# Altium project line-detector.PrjPCB
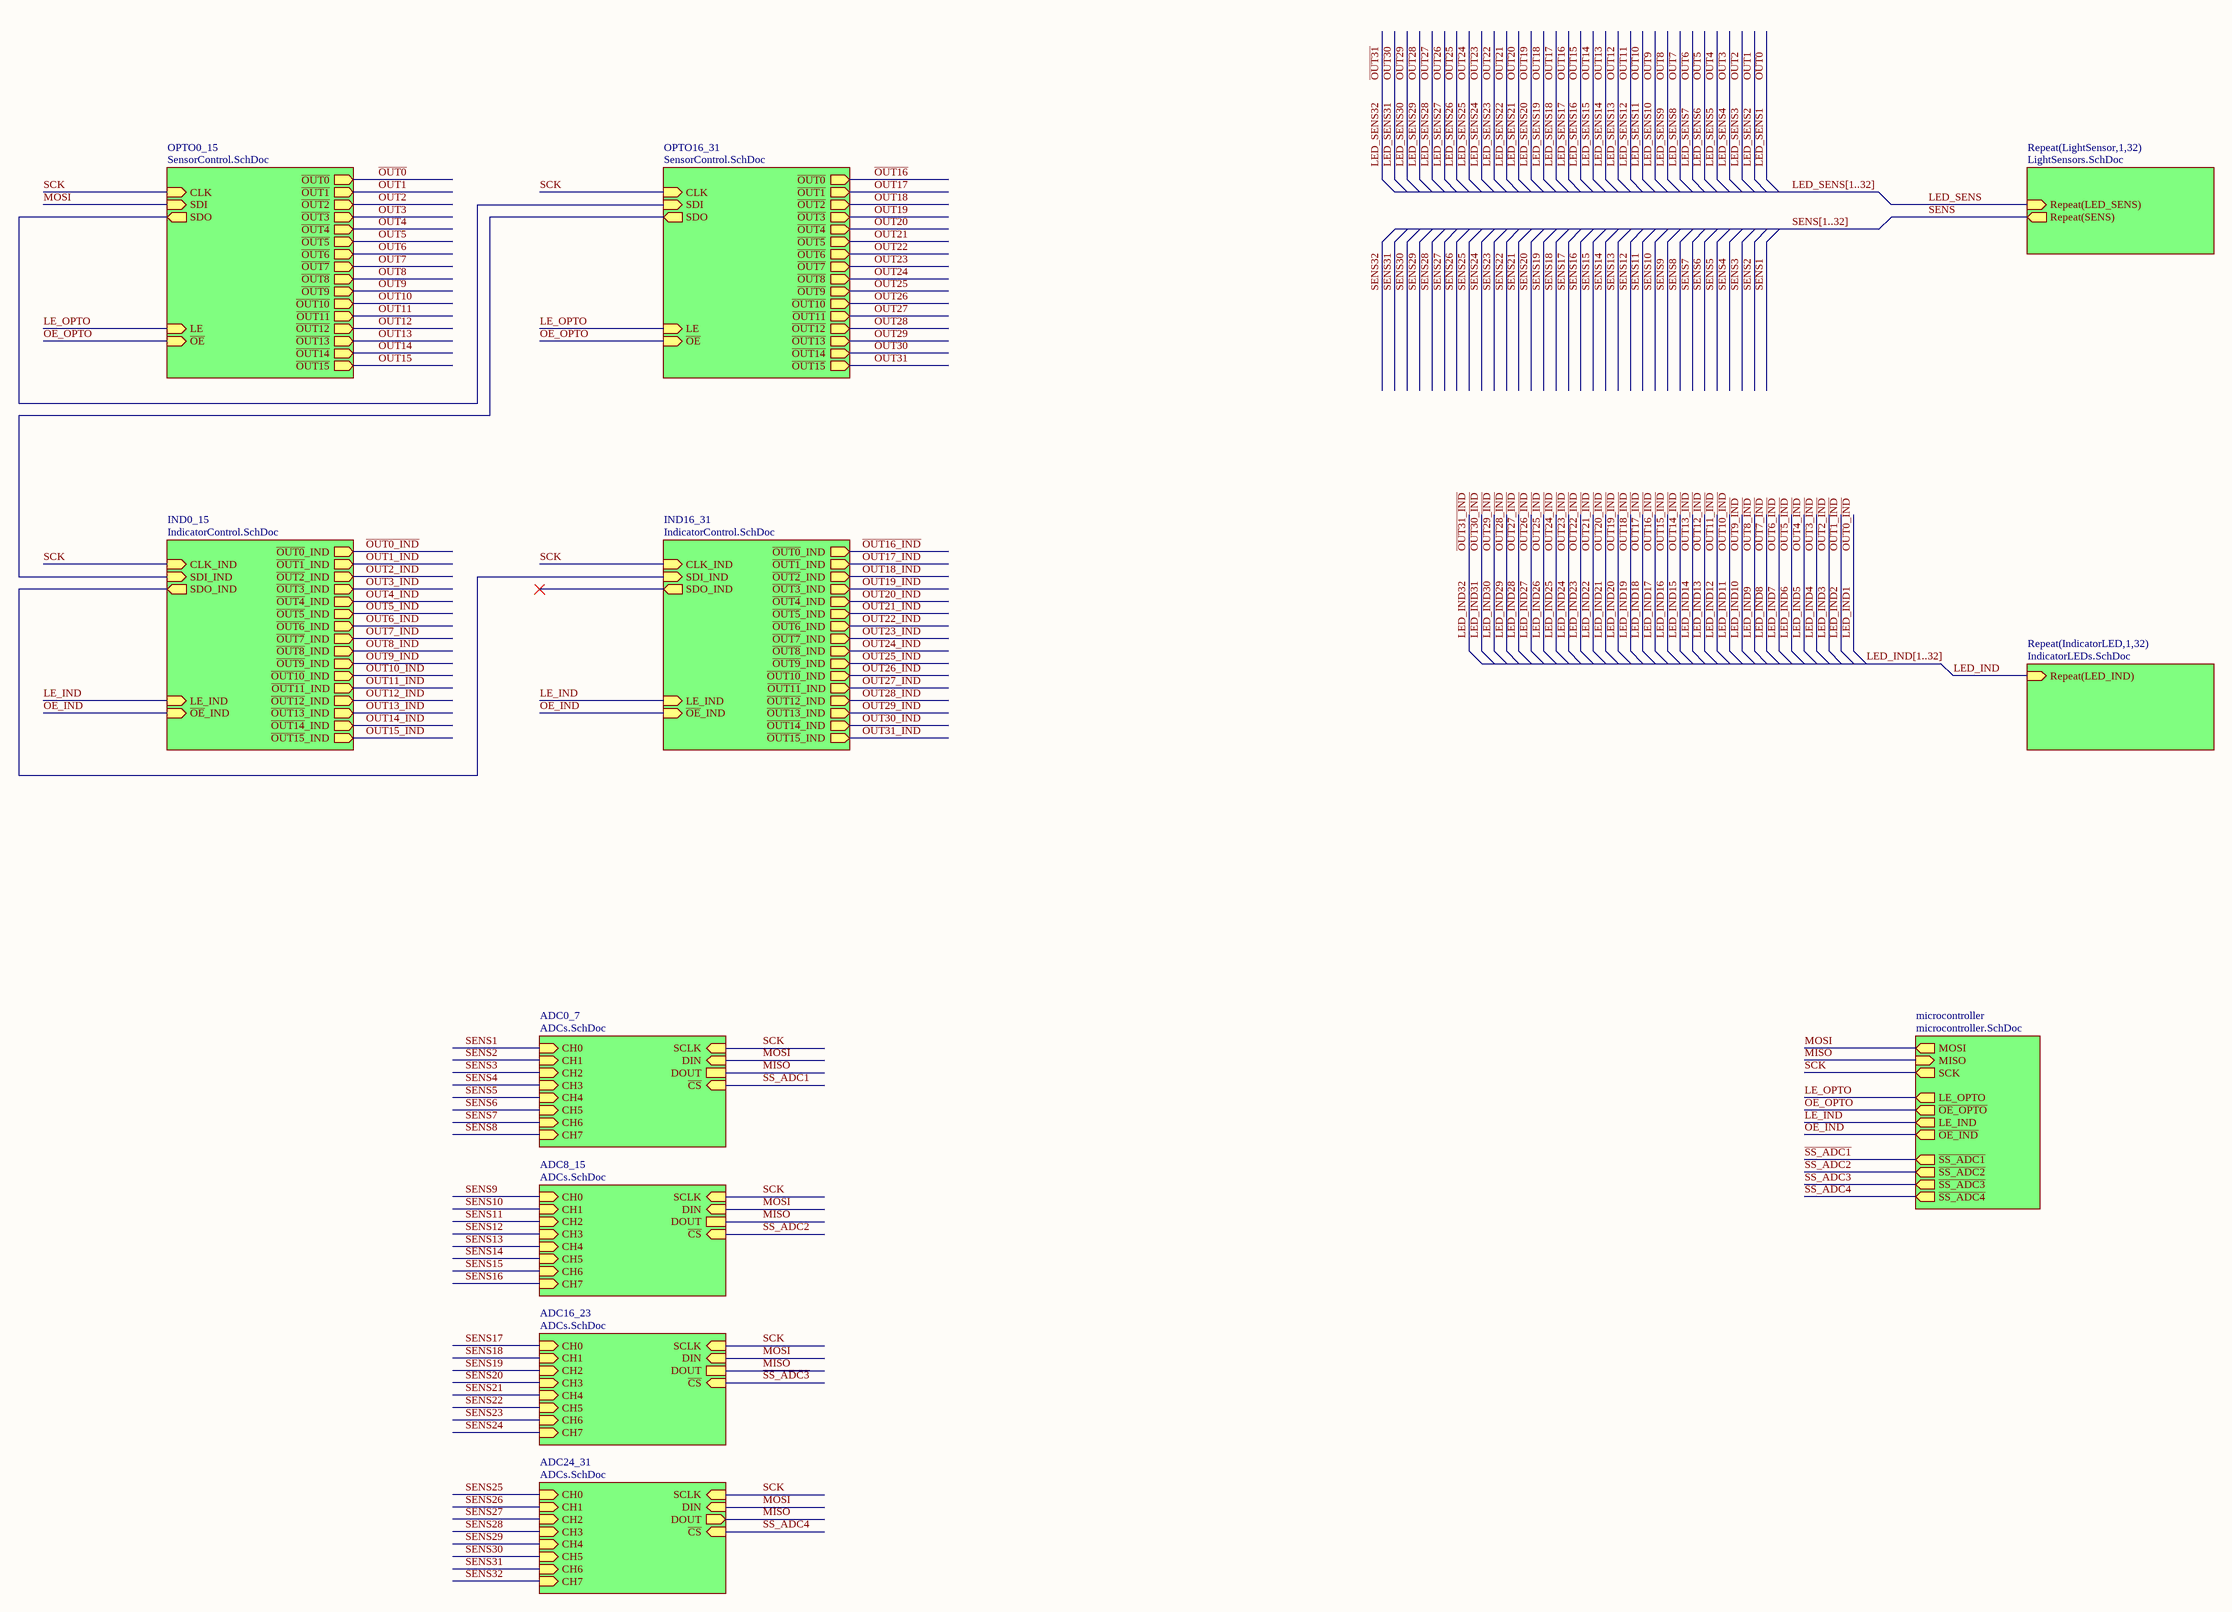
[diagram p0: Main.SchDoc]
7 sheets, 134 parts. Net scope: hierarchical (ports join the sheet entries above them; power ports are global).
Board files: Main.PcbDoc, RPI 3.PcbDoc
Sheets:
  Main.SchDoc
    OPTO0_15 = SensorControl.SchDoc
    OPTO16_31 = SensorControl.SchDoc
    IND0_15 = IndicatorControl.SchDoc
    IND16_31 = IndicatorControl.SchDoc
    microcontroller = microcontroller.SchDoc
    ADC0_7 = ADCs.SchDoc
    ADC8_15 = ADCs.SchDoc
    ADC16_23 = ADCs.SchDoc
    ADC24_31 = ADCs.SchDoc
    IndicatorLED1 = IndicatorLEDs.SchDoc
    IndicatorLED2 = IndicatorLEDs.SchDoc
    IndicatorLED3 = IndicatorLEDs.SchDoc
    IndicatorLED4 = IndicatorLEDs.SchDoc
    IndicatorLED5 = IndicatorLEDs.SchDoc
    IndicatorLED6 = IndicatorLEDs.SchDoc
    IndicatorLED7 = IndicatorLEDs.SchDoc
    IndicatorLED8 = IndicatorLEDs.SchDoc
    IndicatorLED9 = IndicatorLEDs.SchDoc
    IndicatorLED10 = IndicatorLEDs.SchDoc
    IndicatorLED11 = IndicatorLEDs.SchDoc
    IndicatorLED12 = IndicatorLEDs.SchDoc
    IndicatorLED13 = IndicatorLEDs.SchDoc
    IndicatorLED14 = IndicatorLEDs.SchDoc
    IndicatorLED15 = IndicatorLEDs.SchDoc
    IndicatorLED16 = IndicatorLEDs.SchDoc
    IndicatorLED17 = IndicatorLEDs.SchDoc
    IndicatorLED18 = IndicatorLEDs.SchDoc
    IndicatorLED19 = IndicatorLEDs.SchDoc
    IndicatorLED20 = IndicatorLEDs.SchDoc
    IndicatorLED21 = IndicatorLEDs.SchDoc
    IndicatorLED22 = IndicatorLEDs.SchDoc
    IndicatorLED23 = IndicatorLEDs.SchDoc
    IndicatorLED24 = IndicatorLEDs.SchDoc
    IndicatorLED25 = IndicatorLEDs.SchDoc
    IndicatorLED26 = IndicatorLEDs.SchDoc
    IndicatorLED27 = IndicatorLEDs.SchDoc
    IndicatorLED28 = IndicatorLEDs.SchDoc
    IndicatorLED29 = IndicatorLEDs.SchDoc
    IndicatorLED30 = IndicatorLEDs.SchDoc
    IndicatorLED31 = IndicatorLEDs.SchDoc
    IndicatorLED32 = IndicatorLEDs.SchDoc
    LightSensor1 = LightSensors.SchDoc
    LightSensor2 = LightSensors.SchDoc
    LightSensor3 = LightSensors.SchDoc
    LightSensor4 = LightSensors.SchDoc
    LightSensor5 = LightSensors.SchDoc
    LightSensor6 = LightSensors.SchDoc
    LightSensor7 = LightSensors.SchDoc
    LightSensor8 = LightSensors.SchDoc
    LightSensor9 = LightSensors.SchDoc
    LightSensor10 = LightSensors.SchDoc
    LightSensor11 = LightSensors.SchDoc
    LightSensor12 = LightSensors.SchDoc
    LightSensor13 = LightSensors.SchDoc
    LightSensor14 = LightSensors.SchDoc
    LightSensor15 = LightSensors.SchDoc
    LightSensor16 = LightSensors.SchDoc
    LightSensor17 = LightSensors.SchDoc
    LightSensor18 = LightSensors.SchDoc
    LightSensor19 = LightSensors.SchDoc
    LightSensor20 = LightSensors.SchDoc
    LightSensor21 = LightSensors.SchDoc
    LightSensor22 = LightSensors.SchDoc
    LightSensor23 = LightSensors.SchDoc
    LightSensor24 = LightSensors.SchDoc
    LightSensor25 = LightSensors.SchDoc
    LightSensor26 = LightSensors.SchDoc
    LightSensor27 = LightSensors.SchDoc
    LightSensor28 = LightSensors.SchDoc
    LightSensor29 = LightSensors.SchDoc
    LightSensor30 = LightSensors.SchDoc
    LightSensor31 = LightSensors.SchDoc
    LightSensor32 = LightSensors.SchDoc

## Sheet Main.SchDoc
size A2

### Sub-sheets
ADC0_7 = ADCs.SchDoc: CH0 (in), CH1 (in), CH2 (in), CH3 (in), CH4 (in), CH5 (in), CH6 (in), CH7 (in), SCLK (in), ~{CS} (in), DIN (in), DOUT
ADC8_15 = ADCs.SchDoc: CH0 (in), CH1 (in), CH2 (in), CH3 (in), CH4 (in), CH5 (in), CH6 (in), CH7 (in), SCLK (in), ~{CS} (in), DIN (in), DOUT
ADC16_23 = ADCs.SchDoc: CH0 (in), CH1 (in), CH2 (in), CH3 (in), CH4 (in), CH5 (in), CH6 (in), CH7 (in), SCLK (in), ~{CS} (in), DIN (in), DOUT
ADC24_31 = ADCs.SchDoc: CH0 (in), CH1 (in), CH2 (in), CH3 (in), CH4 (in), CH5 (in), CH6 (in), CH7 (in), SCLK (in), ~{CS} (in), DIN (in), DOUT (out)
IND0_15 = IndicatorControl.SchDoc: ~{OUT0}_IND (out), ~{OUT1}_IND (out), ~{OUT2}_IND (out), ~{OUT3}_IND (out), ~{OUT4}_IND (out), ~{OUT5}_IND (out), ~{OUT6}_IND (out), ~{OUT7}_IND (out), ~{OUT8}_IND (out), ~{OUT9}_IND (out), ~{OUT10}_IND (out), ~{OUT11}_IND (out), ~{OUT12}_IND (out), ~{OUT13}_IND (out), ~{OUT14}_IND (out), ~{OUT15}_IND (out), SDI_IND (in), ~{OE}_IND (in), CLK_IND (in), LE_IND (in), SDO_IND (out)
IND16_31 = IndicatorControl.SchDoc: ~{OUT0}_IND (out), ~{OUT1}_IND (out), ~{OUT2}_IND (out), ~{OUT3}_IND (out), ~{OUT4}_IND (out), ~{OUT5}_IND (out), ~{OUT6}_IND (out), ~{OUT7}_IND (out), ~{OUT8}_IND (out), ~{OUT9}_IND (out), ~{OUT10}_IND (out), ~{OUT11}_IND (out), ~{OUT12}_IND (out), ~{OUT13}_IND (out), ~{OUT14}_IND (out), ~{OUT15}_IND (out), SDI_IND (in), ~{OE}_IND (in), CLK_IND (in), LE_IND (in), SDO_IND (out)
microcontroller = microcontroller.SchDoc: LE_IND (out), ~{OE_IND} (out), ~{SS_ADC4} (out), LE_OPTO (out), ~{SS_ADC3} (out), MOSI (out), SCK (out), ~{OE_OPTO} (out), ~{SS_ADC1} (out), ~{SS_ADC2} (out), MISO (in)
OPTO0_15 = SensorControl.SchDoc: ~{OUT0} (out), ~{OUT1} (out), ~{OUT2} (out), ~{OUT3} (out), ~{OUT4} (out), ~{OUT5} (out), ~{OUT6} (out), ~{OUT7} (out), ~{OUT8} (out), ~{OUT9} (out), ~{OUT10} (out), ~{OUT11} (out), ~{OUT12} (out), ~{OUT13} (out), ~{OUT14} (out), ~{OUT15} (out), SDI (in), ~{OE} (in), CLK (in), LE (in), SDO (out)
OPTO16_31 = SensorControl.SchDoc: ~{OUT0} (out), ~{OUT1} (out), ~{OUT2} (out), ~{OUT3} (out), ~{OUT4} (out), ~{OUT5} (out), ~{OUT6} (out), ~{OUT7} (out), ~{OUT8} (out), ~{OUT9} (out), ~{OUT10} (out), ~{OUT11} (out), ~{OUT12} (out), ~{OUT13} (out), ~{OUT14} (out), ~{OUT15} (out), SDI (in), ~{OE} (in), CLK (in), LE (in), SDO (out)
Repeat(IndicatorLED,1,32) = IndicatorLEDs.SchDoc: Repeat(LED_IND) (in)
Repeat(LightSensor,1,32) = LightSensors.SchDoc: Repeat(SENS) (out), Repeat(LED_SENS) (in)

### Nets
LE_IND: sheet IND0_15/LE_IND, sheet IND16_31/LE_IND, sheet microcontroller/LE_IND
LE_OPTO: sheet OPTO0_15/LE, sheet OPTO16_31/LE, sheet microcontroller/LE_OPTO
LED_IND: sheet Repeat(IndicatorLED,1,32)/Repeat(LED_IND)
LED_SENS: sheet Repeat(LightSensor,1,32)/Repeat(LED_SENS)
MISO: sheet microcontroller/MISO, sheet ADC0_7/DOUT, sheet ADC8_15/DOUT, sheet ADC16_23/DOUT, sheet ADC24_31/DOUT
MOSI: sheet OPTO0_15/SDI, sheet microcontroller/MOSI, sheet ADC0_7/DIN, sheet ADC8_15/DIN, sheet ADC16_23/DIN, sheet ADC24_31/DIN
~{OE_IND}: sheet IND0_15/~{OE}_IND, sheet IND16_31/~{OE}_IND, sheet microcontroller/~{OE_IND}
~{OE_OPTO}: sheet OPTO0_15/~{OE}, sheet OPTO16_31/~{OE}, sheet microcontroller/~{OE_OPTO}
~{SS_ADC1}: sheet microcontroller/~{SS_ADC1}, sheet ADC0_7/~{CS}
~{SS_ADC2}: sheet microcontroller/~{SS_ADC2}, sheet ADC8_15/~{CS}
~{SS_ADC3}: sheet microcontroller/~{SS_ADC3}, sheet ADC16_23/~{CS}
~{SS_ADC4}: sheet microcontroller/~{SS_ADC4}, sheet ADC24_31/~{CS}
SCK: sheet OPTO0_15/CLK, sheet OPTO16_31/CLK, sheet IND0_15/CLK_IND, sheet IND16_31/CLK_IND, sheet microcontroller/SCK, sheet ADC0_7/SCLK, sheet ADC8_15/SCLK, sheet ADC16_23/SCLK, sheet ADC24_31/SCLK
SENS: sheet Repeat(LightSensor,1,32)/Repeat(SENS)
NetIND0_15_2: sheet OPTO16_31/SDO, sheet IND0_15/SDI_IND
NetIND0_15_22: sheet IND0_15/SDO_IND, sheet IND16_31/SDI_IND
NetOPTO0_15_22: sheet OPTO0_15/SDO, sheet OPTO16_31/SDI

### Buses and harness runs
bus LED_IND[1..32]
bus LED_SENS[1..32]
bus SENS[1..32]

## Sheet SensorControl.SchDoc
size A4
Used 2 times, as channels OPTO0_15, OPTO16_31. Parts and nets are listed once, with the designators drawn on the sheet.
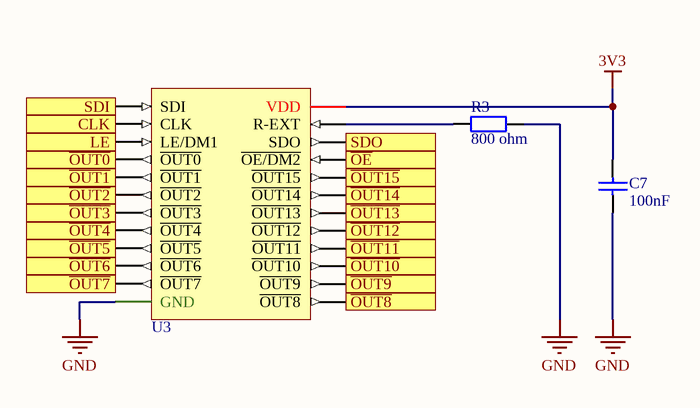
[diagram p1: SensorControl.SchDoc]

### Parts
C7  100nF  [FP_0805_CAP_085]
R3  Resistance: 800 ohm  [0805-W]  (hidden comment: CRCW0805806RFKEA)
U3  STP16CP05TTR  [24-Pin TSSOP]  (value not drawn)

### Ports
CLK (in), LE (in), SDI (in), SDO (out), ~{OE} (in), ~{OUT0} (out), ~{OUT1} (out), ~{OUT2} (out), ~{OUT3} (out), ~{OUT4} (out), ~{OUT5} (out), ~{OUT6} (out), ~{OUT7} (out), ~{OUT8} (out), ~{OUT9} (out), ~{OUT10} (out), ~{OUT11} (out), ~{OUT12} (out), ~{OUT13} (out), ~{OUT14} (out), ~{OUT15} (out)

### Nets
3V3: C7.2 U3.24(VDD)
GND: C7.1 R3.2 U3.1(GND)
CLK: U3.3(CLK) ; port CLK
LE: U3.4(LE/DM1) ; port LE
~{OE}: U3.21(~{OE/DM2}) ; port ~{OE}
~{OUT0}: U3.5(~{OUT0}) ; port ~{OUT0}
~{OUT1}: U3.6(~{OUT1}) ; port ~{OUT1}
~{OUT10}: U3.15(~{OUT10}) ; port ~{OUT10}
~{OUT11}: U3.16(~{OUT11}) ; port ~{OUT11}
~{OUT12}: U3.17(~{OUT12}) ; port ~{OUT12}
~{OUT13}: U3.18(~{OUT13}) ; port ~{OUT13}
~{OUT14}: U3.19(~{OUT14}) ; port ~{OUT14}
~{OUT15}: U3.20(~{OUT15}) ; port ~{OUT15}
~{OUT2}: U3.7(~{OUT2}) ; port ~{OUT2}
~{OUT3}: U3.8(~{OUT3}) ; port ~{OUT3}
~{OUT4}: U3.9(~{OUT4}) ; port ~{OUT4}
~{OUT5}: U3.10(~{OUT5}) ; port ~{OUT5}
~{OUT6}: U3.11(~{OUT6}) ; port ~{OUT6}
~{OUT7}: U3.12(~{OUT7}) ; port ~{OUT7}
~{OUT8}: U3.13(~{OUT8}) ; port ~{OUT8}
~{OUT9}: U3.14(~{OUT9}) ; port ~{OUT9}
SDI: U3.2(SDI) ; port SDI
SDO: U3.22(SDO) ; port SDO
NetR3_1: R3.1 U3.23(R-EXT)

### Channels
OPTO0_15: designators C7=C7#1 R3=R3#1 U3=OPTO0_15; ports CLK=SCK LE=LE_OPTO SDI=MOSI SDO=NetOPTO0_15_22 ~{OE}=~{OE_OPTO} ~{OUT0}=LED_SENS1 ~{OUT1}=LED_SENS2 ~{OUT2}=LED_SENS3 ~{OUT3}=LED_SENS4 ~{OUT4}=LED_SENS5 ~{OUT5}=LED_SENS6 ~{OUT6}=LED_SENS7 ~{OUT7}=LED_SENS8 ~{OUT8}=LED_SENS9 ~{OUT9}=LED_SENS10 ~{OUT10}=LED_SENS11 ~{OUT11}=LED_SENS12 ~{OUT12}=LED_SENS13 ~{OUT13}=LED_SENS14 ~{OUT14}=LED_SENS15 ~{OUT15}=LED_SENS16
OPTO16_31: designators C7=C7#2 R3=R3#2 U3=OPTO16_31; ports CLK=SCK LE=LE_OPTO SDI=NetOPTO0_15_22 SDO=NetIND0_15_2 ~{OE}=~{OE_OPTO} ~{OUT0}=LED_SENS17 ~{OUT1}=LED_SENS18 ~{OUT2}=LED_SENS19 ~{OUT3}=LED_SENS20 ~{OUT4}=LED_SENS21 ~{OUT5}=LED_SENS22 ~{OUT6}=LED_SENS23 ~{OUT7}=LED_SENS24 ~{OUT8}=LED_SENS25 ~{OUT9}=LED_SENS26 ~{OUT10}=LED_SENS27 ~{OUT11}=LED_SENS28 ~{OUT12}=LED_SENS29 ~{OUT13}=LED_SENS30 ~{OUT14}=LED_SENS31 ~{OUT15}=LED_SENS32

### Library data of the parts
C7 = CAP 100nF: Capacitor; Tolerance: +80%/-20%; Voltage: 25V; Reference: 1759167; Name: SMD Multilayer Ceramic Capacitor, 0805; Supplier: Farnell; Value: 100nF
R3 = CRCW0805806RFKEA: RES, THICK FILM, 806R, 1%, 0.125W, 0805
U3 = STP16CP05TTR: Led Driver, 16 Outputs, Constant Current, 3V-5.5V in, 30MHz switch, 20V/100mA out, TSSOP-24

## Sheet IndicatorControl.SchDoc
size A4
Used 2 times, as channels IND0_15, IND16_31. Parts and nets are listed once, with the designators drawn on the sheet.
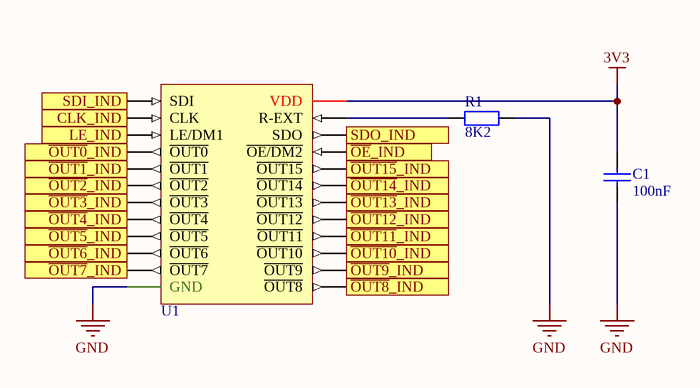
[diagram p2: IndicatorControl.SchDoc]

### Parts
C1  100nF  [FP_0805_CAP_085]
R1  8K2  [FP_0805_RES]
U1  STP16CP05TTR  [24-Pin TSSOP]  (value not drawn)

### Ports
CLK_IND (in), LE_IND (in), SDI_IND (in), SDO_IND (out), ~{OE}_IND (in), ~{OUT0}_IND (out), ~{OUT1}_IND (out), ~{OUT2}_IND (out), ~{OUT3}_IND (out), ~{OUT4}_IND (out), ~{OUT5}_IND (out), ~{OUT6}_IND (out), ~{OUT7}_IND (out), ~{OUT8}_IND (out), ~{OUT9}_IND (out), ~{OUT10}_IND (out), ~{OUT11}_IND (out), ~{OUT12}_IND (out), ~{OUT13}_IND (out), ~{OUT14}_IND (out), ~{OUT15}_IND (out)

### Nets
3V3: C1.2 U1.24(VDD)
GND: C1.1 R1.2 U1.1(GND)
CLK_IND: U1.3(CLK) ; port CLK_IND
LE_IND: U1.4(LE/DM1) ; port LE_IND
~{OE}_IND: U1.21(~{OE/DM2}) ; port ~{OE}_IND
~{OUT0}_IND: U1.5(~{OUT0}) ; port ~{OUT0}_IND
~{OUT10}_IND: U1.15(~{OUT10}) ; port ~{OUT10}_IND
~{OUT11}_IND: U1.16(~{OUT11}) ; port ~{OUT11}_IND
~{OUT12}_IND: U1.17(~{OUT12}) ; port ~{OUT12}_IND
~{OUT13}_IND: U1.18(~{OUT13}) ; port ~{OUT13}_IND
~{OUT14}_IND: U1.19(~{OUT14}) ; port ~{OUT14}_IND
~{OUT15}_IND: U1.20(~{OUT15}) ; port ~{OUT15}_IND
~{OUT1}_IND: U1.6(~{OUT1}) ; port ~{OUT1}_IND
~{OUT2}_IND: U1.7(~{OUT2}) ; port ~{OUT2}_IND
~{OUT3}_IND: U1.8(~{OUT3}) ; port ~{OUT3}_IND
~{OUT4}_IND: U1.9(~{OUT4}) ; port ~{OUT4}_IND
~{OUT5}_IND: U1.10(~{OUT5}) ; port ~{OUT5}_IND
~{OUT6}_IND: U1.11(~{OUT6}) ; port ~{OUT6}_IND
~{OUT7}_IND: U1.12(~{OUT7}) ; port ~{OUT7}_IND
~{OUT8}_IND: U1.13(~{OUT8}) ; port ~{OUT8}_IND
~{OUT9}_IND: U1.14(~{OUT9}) ; port ~{OUT9}_IND
SDI_IND: U1.2(SDI) ; port SDI_IND
SDO_IND: U1.22(SDO) ; port SDO_IND
NetR1_1: R1.1 U1.23(R-EXT)

### Channels
IND0_15: designators C1=C1#1 R1=R1#1 U1=IND0_15; ports CLK_IND=SCK LE_IND=LE_IND SDI_IND=NetIND0_15_2 SDO_IND=NetIND0_15_22 ~{OE}_IND=~{OE_IND} ~{OUT0}_IND=LED_IND1 ~{OUT1}_IND=LED_IND2 ~{OUT2}_IND=LED_IND3 ~{OUT3}_IND=LED_IND4 ~{OUT4}_IND=LED_IND5 ~{OUT5}_IND=LED_IND6 ~{OUT6}_IND=LED_IND7 ~{OUT7}_IND=LED_IND8 ~{OUT8}_IND=LED_IND9 ~{OUT9}_IND=LED_IND10 ~{OUT10}_IND=LED_IND11 ~{OUT11}_IND=LED_IND12 ~{OUT12}_IND=LED_IND13 ~{OUT13}_IND=LED_IND14 ~{OUT14}_IND=LED_IND15 ~{OUT15}_IND=LED_IND16
IND16_31: designators C1=C1#2 R1=R1#2 U1=IND16_31; ports CLK_IND=SCK LE_IND=LE_IND SDI_IND=NetIND0_15_22 SDO_IND=NetIND16_31_22 ~{OE}_IND=~{OE_IND} ~{OUT0}_IND=LED_IND17 ~{OUT1}_IND=LED_IND18 ~{OUT2}_IND=LED_IND19 ~{OUT3}_IND=LED_IND20 ~{OUT4}_IND=LED_IND21 ~{OUT5}_IND=LED_IND22 ~{OUT6}_IND=LED_IND23 ~{OUT7}_IND=LED_IND24 ~{OUT8}_IND=LED_IND25 ~{OUT9}_IND=LED_IND26 ~{OUT10}_IND=LED_IND27 ~{OUT11}_IND=LED_IND28 ~{OUT12}_IND=LED_IND29 ~{OUT13}_IND=LED_IND30 ~{OUT14}_IND=LED_IND31 ~{OUT15}_IND=LED_IND32

### Library data of the parts
C1 = CAP 100nF: as C7 on sheet SensorControl; Supplier: Farnell; Value: 100nF
R1 = RES 8K2: Resistor; Tolerance: 5%; Power: 125mW; Name: YAGEO (PHYCOMP)  RC0805JR-078K2L  SMD Chip Resistor, Thick Film, 8.2 kohm; Reference: 9234128; Supplier: Farnell; Value: 8K2
U1 = STP16CP05TTR: as U3 on sheet SensorControl

## Sheet microcontroller.SchDoc
size A
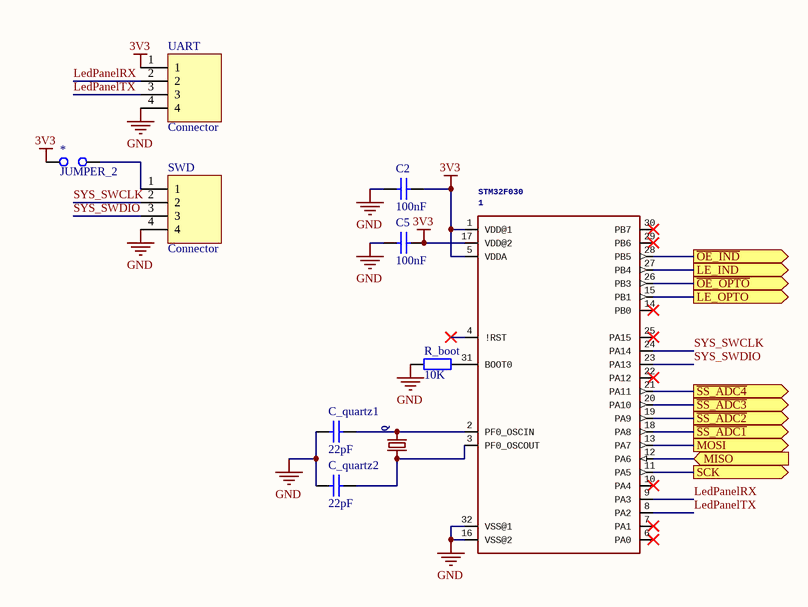
[diagram p3: microcontroller.SchDoc]

### Parts
1  STM32F030  [TQFP32-08]
C2  100nF  [FP_0805_CAP_085]
C5  100nF  [FP_0805_CAP_085]
C_quartz1  22pF  [FP_0805_CAP_085]
C_quartz2  22pF  [FP_0805_CAP_085]
Q  (no value)  [CSM-7X-DU]
R_boot  10K  [FP_0805_RES]
SWD  Connector  [FP_CONN4_TUSKE_254MM]
UART  Connector  [FP_CONN4_TUSKE_254MM]
Vcc  JUMPER_2  [JUMPER_2]

### Ports
LE_IND (out), LE_OPTO (out), MISO (in), MOSI (out), SCK (out), ~{OE_IND} (out), ~{OE_OPTO} (out), ~{SS_ADC1} (out), ~{SS_ADC2} (out), ~{SS_ADC3} (out), ~{SS_ADC4} (out)

### Nets
3V3: 1.1(VDD@1) 1.5(VDDA) 1.17(VDD@2) C2.2 C5.2 UART.1 Vcc.1(C1)
GND: 1.16(VSS@2) 1.32(VSS@1) C2.1 C5.1 C_quartz1.1 C_quartz2.1 R_boot.1 SWD.4 UART.4
LE_IND: 1.27(PB4) ; port LE_IND
LE_OPTO: 1.15(PB1) ; port LE_OPTO
LedPanelRX: 1.9(PA3) UART.2
LedPanelTX: 1.8(PA2) UART.3
MISO: 1.12(PA6) ; port MISO
MOSI: 1.13(PA7) ; port MOSI
~{OE_IND}: 1.28(PB5) ; port ~{OE_IND}
~{OE_OPTO}: 1.26(PB3) ; port ~{OE_OPTO}
~{SS_ADC1}: 1.18(PA8) ; port ~{SS_ADC1}
~{SS_ADC2}: 1.19(PA9) ; port ~{SS_ADC2}
~{SS_ADC3}: 1.20(PA10) ; port ~{SS_ADC3}
~{SS_ADC4}: 1.21(PA11) ; port ~{SS_ADC4}
SCK: 1.11(PA5) ; port SCK
SYS_SWCLK: 1.24(PA14) SWD.2
SYS_SWDIO: 1.23(PA13) SWD.3
Net1_2: 1.2(PF0_OSCIN) C_quartz1.2 Q.2
Net1_3: 1.3(PF0_OSCOUT) C_quartz2.2 Q.1
Net1_31: 1.31(BOOT0) R_boot.2
NetSWD_1: SWD.1 Vcc.2(C2)

Not connected (* = marked no-connect by the designer): 1 4(!RST)* 6(PA0)* 7(PA1)* 10(PA4)* 14(PB0)* 22(PA12)* 25(PA15)* 29(PB6)* 30(PB7)*

### Library data of the parts
1 = STM32F030: GateName_1: G$1; SymbolName_1: STM32F030X; LibraryName: stm32F030x; DeviceSetName: STM32F030; Package: TQFP32-08
C2 C5 = CAP 100nF: as C7 on sheet SensorControl; Supplier: Farnell; Value: 100nF
C_quartz1 C_quartz2 = CAP 22pF: Capacitor; Tolerance: 5%; Voltage: 50V; Reference: 1759195; Name: SMD Multilayer Ceramic Capacitor, 0805; Supplier: Farnell; Value: 22pF
Q = CSM-7X-DU: GateName_1: P; SymbolName_1: Q; LibraryName: crystal; DeviceSetName: CSM-7X-DU; Package: CSM-7X-DU; OC_FARNELL: unknown; OC_NEWARK: unknown
R_boot = RES 10K: Resistor; Tolerance: 5%; Power: 125mW; Name: YAGEO (PHYCOMP)  RC0805JR-0710KL  SMD Chip Resistor, Thick Film, 10 kohm; Reference: 9234136; Supplier: Farnell; Value: 10K
SWD UART = Connector_4pin: 4pin Connector

## Sheet ADCs.SchDoc
size A4
Used 4 times, as channels ADC0_7, ADC8_15, ADC16_23, ADC24_31. Parts and nets are listed once, with the designators drawn on the sheet.
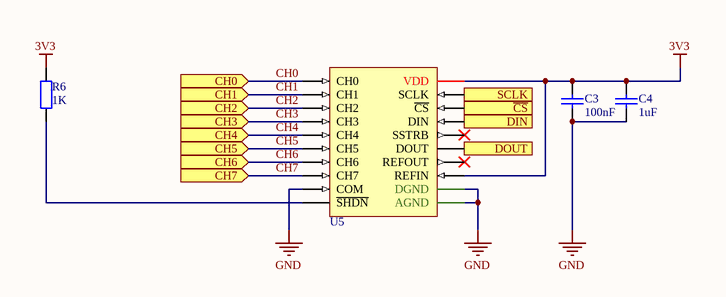
[diagram p4: ADCs.SchDoc]

### Parts
C3  100nF  [FP_0805_CAP_085]
C4  1uF  [FP_0805_CAP_085]
R6  1K  [FP_0805_RES]
U5  MAX1110CAP+  [20-Pin SSOP]  (value not drawn)

### Ports
CH0 (in), CH1 (in), CH2 (in), CH3 (in), CH4 (in), CH5 (in), CH6 (in), CH7 (in), DIN (in), DOUT (out), SCLK (in), ~{CS} (in)

### Nets
3V3: C3.2 C4.2 R6.2 U5.11(REFIN) U5.20(VDD)
GND: C3.1 C4.1 U5.9(COM) U5.13(AGND) U5.14(DGND)
~{CS}: U5.18(~{CS}) ; port ~{CS}
CH0: U5.1(CH0) ; port CH0
CH1: U5.2(CH1) ; port CH1
CH2: U5.3(CH2) ; port CH2
CH3: U5.4(CH3) ; port CH3
CH4: U5.5(CH4) ; port CH4
CH5: U5.6(CH5) ; port CH5
CH6: U5.7(CH6) ; port CH6
CH7: U5.8(CH7) ; port CH7
DIN: U5.17(DIN) ; port DIN
DOUT: U5.15(DOUT) ; port DOUT
SCLK: U5.19(SCLK) ; port SCLK
NetR6_1: R6.1 U5.10(~{SHDN})

Not connected (* = marked no-connect by the designer): U5 12(REFOUT)* 16(SSTRB)*

### Channels
ADC0_7: designators C3=C3#1 C4=C4#1 R6=R6#1 U5=ADC0_7; ports CH0=CH0 CH1=CH1 CH2=CH2 CH3=CH3 CH4=CH4 CH5=CH5 CH6=CH6 CH7=CH7 DIN=MOSI DOUT=MISO SCLK=SCK ~{CS}=~{SS_ADC1}
ADC8_15: designators C3=C3#2 C4=C4#2 R6=R6#2 U5=ADC8_15; ports CH0=CH0 CH1=CH1 CH2=CH2 CH3=CH3 CH4=CH4 CH5=CH5 CH6=CH6 CH7=CH7 DIN=MOSI DOUT=MISO SCLK=SCK ~{CS}=~{SS_ADC2}
ADC16_23: designators C3=C3#3 C4=C4#3 R6=R6#3 U5=ADC16_23; ports CH0=CH0 CH1=CH1 CH2=CH2 CH3=CH3 CH4=CH4 CH5=CH5 CH6=CH6 CH7=CH7 DIN=MOSI DOUT=MISO SCLK=SCK ~{CS}=~{SS_ADC3}
ADC24_31: designators C3=C3#4 C4=C4#4 R6=R6#4 U5=ADC24_31; ports CH0=CH0 CH1=CH1 CH2=CH2 CH3=CH3 CH4=CH4 CH5=CH5 CH6=CH6 CH7=CH7 DIN=MOSI DOUT=MISO SCLK=SCK ~{CS}=~{SS_ADC4}

### Library data of the parts
C3 = CAP 100nF: as C7 on sheet SensorControl; Supplier: Farnell; Value: 100nF
C4 = CAP 1uF: Capacitor; Tolerance: +80%/-20%; Voltage: 25V; Reference: 1828853; Name: SMD Multilayer Ceramic Capacitor, 0805; Supplier: Farnell; Value: 1uF
R6 = RES 1K: Resistor; Tolerance: 5%; Power: 125mW; Name: YAGEO (PHYCOMP)  RC0805JR-071KL  SMD Chip Resistor, Thick Film, 1 kohm; Reference: 9234004; Supplier: Farnell; Value: 1K
U5 = MAX1110CAP+: Analogue to Digital Converter, Low Power, 8 bit, 50 kSPS, Single, 2.7 V, 5.5 V, SSOP

## Sheet IndicatorLEDs.SchDoc
size A4
Used 32 times, as channels IndicatorLED1, IndicatorLED2, IndicatorLED3, IndicatorLED4, IndicatorLED5, IndicatorLED6, IndicatorLED7, IndicatorLED8, IndicatorLED9, IndicatorLED10, IndicatorLED11, IndicatorLED12, IndicatorLED13, IndicatorLED14, IndicatorLED15, IndicatorLED16, IndicatorLED17, IndicatorLED18, IndicatorLED19, IndicatorLED20, IndicatorLED21, IndicatorLED22, IndicatorLED23, IndicatorLED24, IndicatorLED25, IndicatorLED26, IndicatorLED27, IndicatorLED28, IndicatorLED29, IndicatorLED30, IndicatorLED31, IndicatorLED32. Parts and nets are listed once, with the designators drawn on the sheet.
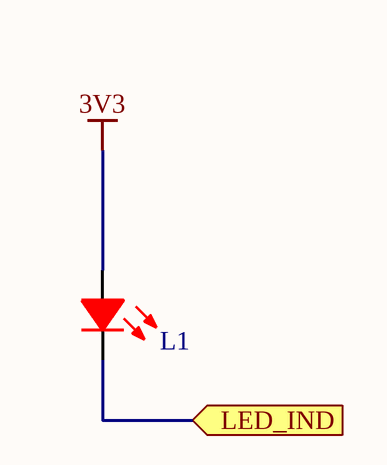
[diagram p5: IndicatorLEDs.SchDoc]

### Parts
L1  KPT-2012SURCK  [0808-LED]  (value not drawn)

### Ports
LED_IND (in)

### Nets
3V3: L1.A
LED_IND: L1.K ; port LED_IND

### Channels
IndicatorLED1: designators end in _IndicatorLED1; ports LED_IND=LED_IND1
IndicatorLED2: designators end in _IndicatorLED2; ports LED_IND=LED_IND2
IndicatorLED3: designators end in _IndicatorLED3; ports LED_IND=LED_IND3
IndicatorLED4: designators end in _IndicatorLED4; ports LED_IND=LED_IND4
IndicatorLED5: designators end in _IndicatorLED5; ports LED_IND=LED_IND5
IndicatorLED6: designators end in _IndicatorLED6; ports LED_IND=LED_IND6
IndicatorLED7: designators end in _IndicatorLED7; ports LED_IND=LED_IND7
IndicatorLED8: designators end in _IndicatorLED8; ports LED_IND=LED_IND8
IndicatorLED9: designators end in _IndicatorLED9; ports LED_IND=LED_IND9
IndicatorLED10: designators end in _IndicatorLED10; ports LED_IND=LED_IND10
IndicatorLED11: designators end in _IndicatorLED11; ports LED_IND=LED_IND11
IndicatorLED12: designators end in _IndicatorLED12; ports LED_IND=LED_IND12
IndicatorLED13: designators end in _IndicatorLED13; ports LED_IND=LED_IND13
IndicatorLED14: designators end in _IndicatorLED14; ports LED_IND=LED_IND14
IndicatorLED15: designators end in _IndicatorLED15; ports LED_IND=LED_IND15
IndicatorLED16: designators end in _IndicatorLED16; ports LED_IND=LED_IND16
IndicatorLED17: designators end in _IndicatorLED17; ports LED_IND=LED_IND17
IndicatorLED18: designators end in _IndicatorLED18; ports LED_IND=LED_IND18
IndicatorLED19: designators end in _IndicatorLED19; ports LED_IND=LED_IND19
IndicatorLED20: designators end in _IndicatorLED20; ports LED_IND=LED_IND20
IndicatorLED21: designators end in _IndicatorLED21; ports LED_IND=LED_IND21
IndicatorLED22: designators end in _IndicatorLED22; ports LED_IND=LED_IND22
IndicatorLED23: designators end in _IndicatorLED23; ports LED_IND=LED_IND23
IndicatorLED24: designators end in _IndicatorLED24; ports LED_IND=LED_IND24
IndicatorLED25: designators end in _IndicatorLED25; ports LED_IND=LED_IND25
IndicatorLED26: designators end in _IndicatorLED26; ports LED_IND=LED_IND26
IndicatorLED27: designators end in _IndicatorLED27; ports LED_IND=LED_IND27
IndicatorLED28: designators end in _IndicatorLED28; ports LED_IND=LED_IND28
IndicatorLED29: designators end in _IndicatorLED29; ports LED_IND=LED_IND29
IndicatorLED30: designators end in _IndicatorLED30; ports LED_IND=LED_IND30
IndicatorLED31: designators end in _IndicatorLED31; ports LED_IND=LED_IND31
IndicatorLED32: designators end in _IndicatorLED32; ports LED_IND=LED_IND32

### Library data of the parts
L1 = KPT-2012SURCK: LED, Low Power, Red, SMD, 2 mA, 1.95 V, 630 nm

## Sheet LightSensors.SchDoc
size A4
Used 32 times, as channels LightSensor1, LightSensor2, LightSensor3, LightSensor4, LightSensor5, LightSensor6, LightSensor7, LightSensor8, LightSensor9, LightSensor10, LightSensor11, LightSensor12, LightSensor13, LightSensor14, LightSensor15, LightSensor16, LightSensor17, LightSensor18, LightSensor19, LightSensor20, LightSensor21, LightSensor22, LightSensor23, LightSensor24, LightSensor25, LightSensor26, LightSensor27, LightSensor28, LightSensor29, LightSensor30, LightSensor31, LightSensor32. Parts and nets are listed once, with the designators drawn on the sheet.
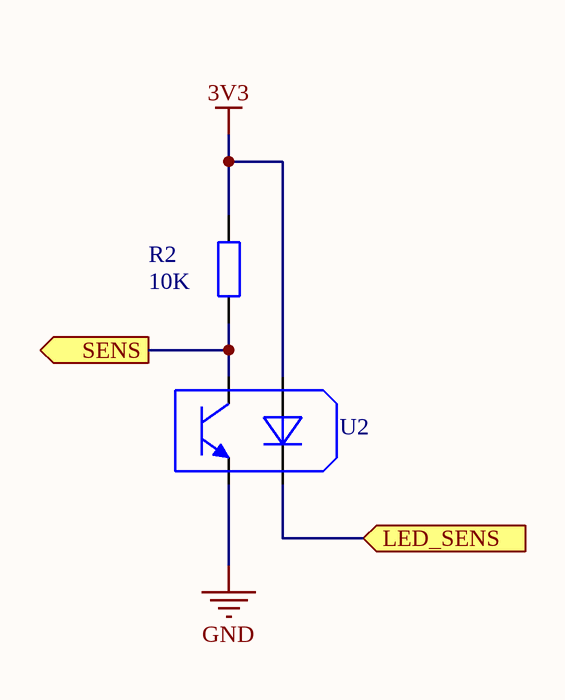
[diagram p6: LightSensors.SchDoc]

### Parts
R2  10K  [FP_0805_RES]
U2  TCRT5000  [TCRT5000_NO_HOLE]  (value not drawn)

### Ports
LED_SENS (in), SENS (out)

### Nets
3V3: R2.2 U2.A
GND: U2.E
LED_SENS: U2.K ; port LED_SENS
SENS: R2.1 U2.C ; port SENS

### Channels
LightSensor1: designators R2=R2_LightSensor1 U2=OPTO1; ports LED_SENS=LED_SENS1 SENS=CH0
LightSensor2: designators end in _LightSensor2; ports LED_SENS=LED_SENS2 SENS=CH1
LightSensor3: designators end in _LightSensor3; ports LED_SENS=LED_SENS3 SENS=CH2
LightSensor4: designators end in _LightSensor4; ports LED_SENS=LED_SENS4 SENS=CH3
LightSensor5: designators end in _LightSensor5; ports LED_SENS=LED_SENS5 SENS=CH4
LightSensor6: designators end in _LightSensor6; ports LED_SENS=LED_SENS6 SENS=CH5
LightSensor7: designators end in _LightSensor7; ports LED_SENS=LED_SENS7 SENS=CH6
LightSensor8: designators end in _LightSensor8; ports LED_SENS=LED_SENS8 SENS=CH7
LightSensor9: designators end in _LightSensor9; ports LED_SENS=LED_SENS9 SENS=CH0
LightSensor10: designators end in _LightSensor10; ports LED_SENS=LED_SENS10 SENS=CH1
LightSensor11: designators end in _LightSensor11; ports LED_SENS=LED_SENS11 SENS=CH2
LightSensor12: designators end in _LightSensor12; ports LED_SENS=LED_SENS12 SENS=CH3
LightSensor13: designators end in _LightSensor13; ports LED_SENS=LED_SENS13 SENS=CH4
LightSensor14: designators end in _LightSensor14; ports LED_SENS=LED_SENS14 SENS=CH5
LightSensor15: designators end in _LightSensor15; ports LED_SENS=LED_SENS15 SENS=CH6
LightSensor16: designators end in _LightSensor16; ports LED_SENS=LED_SENS16 SENS=CH7
LightSensor17: designators end in _LightSensor17; ports LED_SENS=LED_SENS17 SENS=CH0
LightSensor18: designators end in _LightSensor18; ports LED_SENS=LED_SENS18 SENS=CH1
LightSensor19: designators end in _LightSensor19; ports LED_SENS=LED_SENS19 SENS=CH2
LightSensor20: designators end in _LightSensor20; ports LED_SENS=LED_SENS20 SENS=CH3
LightSensor21: designators end in _LightSensor21; ports LED_SENS=LED_SENS21 SENS=CH4
LightSensor22: designators end in _LightSensor22; ports LED_SENS=LED_SENS22 SENS=CH5
LightSensor23: designators end in _LightSensor23; ports LED_SENS=LED_SENS23 SENS=CH6
LightSensor24: designators end in _LightSensor24; ports LED_SENS=LED_SENS24 SENS=CH7
LightSensor25: designators end in _LightSensor25; ports LED_SENS=LED_SENS25 SENS=CH0
LightSensor26: designators end in _LightSensor26; ports LED_SENS=LED_SENS26 SENS=CH1
LightSensor27: designators end in _LightSensor27; ports LED_SENS=LED_SENS27 SENS=CH2
LightSensor28: designators end in _LightSensor28; ports LED_SENS=LED_SENS28 SENS=CH3
LightSensor29: designators end in _LightSensor29; ports LED_SENS=LED_SENS29 SENS=CH4
LightSensor30: designators end in _LightSensor30; ports LED_SENS=LED_SENS30 SENS=CH5
LightSensor31: designators end in _LightSensor31; ports LED_SENS=LED_SENS31 SENS=CH6
LightSensor32: designators R2=R2_LightSensor32 U2=OPTO32; ports LED_SENS=LED_SENS32 SENS=CH7

### Library data of the parts
R2 = RES 10K: as R_boot on sheet microcontroller; Supplier: Farnell; Value: 10K
U2 = TCRT5000: Reflective Photo Interrupter, Phototransistor, Through Hole, 15 mm, 60 mA, 5 Vr, 1.25 Vf

## Nets that join several sheets
3V3: OPTO0_15 (C7#1.2 OPTO0_15.24), OPTO16_31 (C7#2.2 OPTO16_31.24), IND0_15 (C1#1.2 IND0_15.24), IND16_31 (C1#2.2 IND16_31.24), microcontroller (7 pins), ADC0_7 (5 pins), ADC8_15 (5 pins), ADC16_23 (5 pins), ADC24_31 (5 pins), IndicatorLED1 (L1_IndicatorLED1.A), IndicatorLED2 (L1_IndicatorLED2.A), IndicatorLED3 (L1_IndicatorLED3.A), IndicatorLED4 (L1_IndicatorLED4.A), IndicatorLED5 (L1_IndicatorLED5.A), IndicatorLED6 (L1_IndicatorLED6.A), IndicatorLED7 (L1_IndicatorLED7.A), IndicatorLED8 (L1_IndicatorLED8.A), IndicatorLED9 (L1_IndicatorLED9.A), IndicatorLED10 (L1_IndicatorLED10.A), IndicatorLED11 (L1_IndicatorLED11.A), IndicatorLED12 (L1_IndicatorLED12.A), IndicatorLED13 (L1_IndicatorLED13.A), IndicatorLED14 (L1_IndicatorLED14.A), IndicatorLED15 (L1_IndicatorLED15.A), IndicatorLED16 (L1_IndicatorLED16.A), IndicatorLED17 (L1_IndicatorLED17.A), IndicatorLED18 (L1_IndicatorLED18.A), IndicatorLED19 (L1_IndicatorLED19.A), IndicatorLED20 (L1_IndicatorLED20.A), IndicatorLED21 (L1_IndicatorLED21.A), IndicatorLED22 (L1_IndicatorLED22.A), IndicatorLED23 (L1_IndicatorLED23.A), IndicatorLED24 (L1_IndicatorLED24.A), IndicatorLED25 (L1_IndicatorLED25.A), IndicatorLED26 (L1_IndicatorLED26.A), IndicatorLED27 (L1_IndicatorLED27.A), IndicatorLED28 (L1_IndicatorLED28.A), IndicatorLED29 (L1_IndicatorLED29.A), IndicatorLED30 (L1_IndicatorLED30.A), IndicatorLED31 (L1_IndicatorLED31.A), IndicatorLED32 (L1_IndicatorLED32.A), LightSensor1 (OPTO1.A R2_LightSensor1.2), LightSensor2 (R2_LightSensor2.2 U2_LightSensor2.A), LightSensor3 (R2_LightSensor3.2 U2_LightSensor3.A), LightSensor4 (R2_LightSensor4.2 U2_LightSensor4.A), LightSensor5 (R2_LightSensor5.2 U2_LightSensor5.A), LightSensor6 (R2_LightSensor6.2 U2_LightSensor6.A), LightSensor7 (R2_LightSensor7.2 U2_LightSensor7.A), LightSensor8 (R2_LightSensor8.2 U2_LightSensor8.A), LightSensor9 (R2_LightSensor9.2 U2_LightSensor9.A), LightSensor10 (R2_LightSensor10.2 U2_LightSensor10.A), LightSensor11 (R2_LightSensor11.2 U2_LightSensor11.A), LightSensor12 (R2_LightSensor12.2 U2_LightSensor12.A), LightSensor13 (R2_LightSensor13.2 U2_LightSensor13.A), LightSensor14 (R2_LightSensor14.2 U2_LightSensor14.A), LightSensor15 (R2_LightSensor15.2 U2_LightSensor15.A), LightSensor16 (R2_LightSensor16.2 U2_LightSensor16.A), LightSensor17 (R2_LightSensor17.2 U2_LightSensor17.A), LightSensor18 (R2_LightSensor18.2 U2_LightSensor18.A), LightSensor19 (R2_LightSensor19.2 U2_LightSensor19.A), LightSensor20 (R2_LightSensor20.2 U2_LightSensor20.A), LightSensor21 (R2_LightSensor21.2 U2_LightSensor21.A), LightSensor22 (R2_LightSensor22.2 U2_LightSensor22.A), LightSensor23 (R2_LightSensor23.2 U2_LightSensor23.A), LightSensor24 (R2_LightSensor24.2 U2_LightSensor24.A), LightSensor25 (R2_LightSensor25.2 U2_LightSensor25.A), LightSensor26 (R2_LightSensor26.2 U2_LightSensor26.A), LightSensor27 (R2_LightSensor27.2 U2_LightSensor27.A), LightSensor28 (R2_LightSensor28.2 U2_LightSensor28.A), LightSensor29 (R2_LightSensor29.2 U2_LightSensor29.A), LightSensor30 (R2_LightSensor30.2 U2_LightSensor30.A), LightSensor31 (R2_LightSensor31.2 U2_LightSensor31.A), LightSensor32 (OPTO32.A R2_LightSensor32.2)
GND: OPTO0_15 (C7#1.1 OPTO0_15.1 R3#1.2), OPTO16_31 (C7#2.1 OPTO16_31.1 R3#2.2), IND0_15 (C1#1.1 IND0_15.1 R1#1.2), IND16_31 (C1#2.1 IND16_31.1 R1#2.2), microcontroller (9 pins), ADC0_7 (5 pins), ADC8_15 (5 pins), ADC16_23 (5 pins), ADC24_31 (5 pins), LightSensor1 (OPTO1.E), LightSensor2 (U2_LightSensor2.E), LightSensor3 (U2_LightSensor3.E), LightSensor4 (U2_LightSensor4.E), LightSensor5 (U2_LightSensor5.E), LightSensor6 (U2_LightSensor6.E), LightSensor7 (U2_LightSensor7.E), LightSensor8 (U2_LightSensor8.E), LightSensor9 (U2_LightSensor9.E), LightSensor10 (U2_LightSensor10.E), LightSensor11 (U2_LightSensor11.E), LightSensor12 (U2_LightSensor12.E), LightSensor13 (U2_LightSensor13.E), LightSensor14 (U2_LightSensor14.E), LightSensor15 (U2_LightSensor15.E), LightSensor16 (U2_LightSensor16.E), LightSensor17 (U2_LightSensor17.E), LightSensor18 (U2_LightSensor18.E), LightSensor19 (U2_LightSensor19.E), LightSensor20 (U2_LightSensor20.E), LightSensor21 (U2_LightSensor21.E), LightSensor22 (U2_LightSensor22.E), LightSensor23 (U2_LightSensor23.E), LightSensor24 (U2_LightSensor24.E), LightSensor25 (U2_LightSensor25.E), LightSensor26 (U2_LightSensor26.E), LightSensor27 (U2_LightSensor27.E), LightSensor28 (U2_LightSensor28.E), LightSensor29 (U2_LightSensor29.E), LightSensor30 (U2_LightSensor30.E), LightSensor31 (U2_LightSensor31.E), LightSensor32 (OPTO32.E)
CH0: ADC0_7 (ADC0_7.1), LightSensor1 (OPTO1.C R2_LightSensor1.1)
CH0: ADC8_15 (ADC8_15.1), LightSensor9 (R2_LightSensor9.1 U2_LightSensor9.C)
CH0: ADC16_23 (ADC16_23.1), LightSensor17 (R2_LightSensor17.1 U2_LightSensor17.C)
CH0: ADC24_31 (ADC24_31.1), LightSensor25 (R2_LightSensor25.1 U2_LightSensor25.C)
CH1: ADC0_7 (ADC0_7.2), LightSensor2 (R2_LightSensor2.1 U2_LightSensor2.C)
CH1: ADC8_15 (ADC8_15.2), LightSensor10 (R2_LightSensor10.1 U2_LightSensor10.C)
CH1: ADC16_23 (ADC16_23.2), LightSensor18 (R2_LightSensor18.1 U2_LightSensor18.C)
CH1: ADC24_31 (ADC24_31.2), LightSensor26 (R2_LightSensor26.1 U2_LightSensor26.C)
CH2: ADC0_7 (ADC0_7.3), LightSensor3 (R2_LightSensor3.1 U2_LightSensor3.C)
CH2: ADC8_15 (ADC8_15.3), LightSensor11 (R2_LightSensor11.1 U2_LightSensor11.C)
CH2: ADC16_23 (ADC16_23.3), LightSensor19 (R2_LightSensor19.1 U2_LightSensor19.C)
CH2: ADC24_31 (ADC24_31.3), LightSensor27 (R2_LightSensor27.1 U2_LightSensor27.C)
CH3: ADC0_7 (ADC0_7.4), LightSensor4 (R2_LightSensor4.1 U2_LightSensor4.C)
CH3: ADC8_15 (ADC8_15.4), LightSensor12 (R2_LightSensor12.1 U2_LightSensor12.C)
CH3: ADC16_23 (ADC16_23.4), LightSensor20 (R2_LightSensor20.1 U2_LightSensor20.C)
CH3: ADC24_31 (ADC24_31.4), LightSensor28 (R2_LightSensor28.1 U2_LightSensor28.C)
CH4: ADC0_7 (ADC0_7.5), LightSensor5 (R2_LightSensor5.1 U2_LightSensor5.C)
CH4: ADC8_15 (ADC8_15.5), LightSensor13 (R2_LightSensor13.1 U2_LightSensor13.C)
CH4: ADC16_23 (ADC16_23.5), LightSensor21 (R2_LightSensor21.1 U2_LightSensor21.C)
CH4: ADC24_31 (ADC24_31.5), LightSensor29 (R2_LightSensor29.1 U2_LightSensor29.C)
CH5: ADC0_7 (ADC0_7.6), LightSensor6 (R2_LightSensor6.1 U2_LightSensor6.C)
CH5: ADC8_15 (ADC8_15.6), LightSensor14 (R2_LightSensor14.1 U2_LightSensor14.C)
CH5: ADC16_23 (ADC16_23.6), LightSensor22 (R2_LightSensor22.1 U2_LightSensor22.C)
CH5: ADC24_31 (ADC24_31.6), LightSensor30 (R2_LightSensor30.1 U2_LightSensor30.C)
CH6: ADC0_7 (ADC0_7.7), LightSensor7 (R2_LightSensor7.1 U2_LightSensor7.C)
CH6: ADC8_15 (ADC8_15.7), LightSensor15 (R2_LightSensor15.1 U2_LightSensor15.C)
CH6: ADC16_23 (ADC16_23.7), LightSensor23 (R2_LightSensor23.1 U2_LightSensor23.C)
CH6: ADC24_31 (ADC24_31.7), LightSensor31 (R2_LightSensor31.1 U2_LightSensor31.C)
CH7: ADC0_7 (ADC0_7.8), LightSensor8 (R2_LightSensor8.1 U2_LightSensor8.C)
CH7: ADC8_15 (ADC8_15.8), LightSensor16 (R2_LightSensor16.1 U2_LightSensor16.C)
CH7: ADC16_23 (ADC16_23.8), LightSensor24 (R2_LightSensor24.1 U2_LightSensor24.C)
CH7: ADC24_31 (ADC24_31.8), LightSensor32 (OPTO32.C R2_LightSensor32.1)
LE_IND: IND0_15 (IND0_15.4), IND16_31 (IND16_31.4), microcontroller (1.27)
LE_OPTO: OPTO0_15 (OPTO0_15.4), OPTO16_31 (OPTO16_31.4), microcontroller (1.15)
LED_IND1: IND0_15 (IND0_15.5), IndicatorLED1 (L1_IndicatorLED1.K)
LED_IND2: IND0_15 (IND0_15.6), IndicatorLED2 (L1_IndicatorLED2.K)
LED_IND3: IND0_15 (IND0_15.7), IndicatorLED3 (L1_IndicatorLED3.K)
LED_IND4: IND0_15 (IND0_15.8), IndicatorLED4 (L1_IndicatorLED4.K)
LED_IND5: IND0_15 (IND0_15.9), IndicatorLED5 (L1_IndicatorLED5.K)
LED_IND6: IND0_15 (IND0_15.10), IndicatorLED6 (L1_IndicatorLED6.K)
LED_IND7: IND0_15 (IND0_15.11), IndicatorLED7 (L1_IndicatorLED7.K)
LED_IND8: IND0_15 (IND0_15.12), IndicatorLED8 (L1_IndicatorLED8.K)
LED_IND9: IND0_15 (IND0_15.13), IndicatorLED9 (L1_IndicatorLED9.K)
LED_IND10: IND0_15 (IND0_15.14), IndicatorLED10 (L1_IndicatorLED10.K)
LED_IND11: IND0_15 (IND0_15.15), IndicatorLED11 (L1_IndicatorLED11.K)
LED_IND12: IND0_15 (IND0_15.16), IndicatorLED12 (L1_IndicatorLED12.K)
LED_IND13: IND0_15 (IND0_15.17), IndicatorLED13 (L1_IndicatorLED13.K)
LED_IND14: IND0_15 (IND0_15.18), IndicatorLED14 (L1_IndicatorLED14.K)
LED_IND15: IND0_15 (IND0_15.19), IndicatorLED15 (L1_IndicatorLED15.K)
LED_IND16: IND0_15 (IND0_15.20), IndicatorLED16 (L1_IndicatorLED16.K)
LED_IND17: IND16_31 (IND16_31.5), IndicatorLED17 (L1_IndicatorLED17.K)
LED_IND18: IND16_31 (IND16_31.6), IndicatorLED18 (L1_IndicatorLED18.K)
LED_IND19: IND16_31 (IND16_31.7), IndicatorLED19 (L1_IndicatorLED19.K)
LED_IND20: IND16_31 (IND16_31.8), IndicatorLED20 (L1_IndicatorLED20.K)
LED_IND21: IND16_31 (IND16_31.9), IndicatorLED21 (L1_IndicatorLED21.K)
LED_IND22: IND16_31 (IND16_31.10), IndicatorLED22 (L1_IndicatorLED22.K)
LED_IND23: IND16_31 (IND16_31.11), IndicatorLED23 (L1_IndicatorLED23.K)
LED_IND24: IND16_31 (IND16_31.12), IndicatorLED24 (L1_IndicatorLED24.K)
LED_IND25: IND16_31 (IND16_31.13), IndicatorLED25 (L1_IndicatorLED25.K)
LED_IND26: IND16_31 (IND16_31.14), IndicatorLED26 (L1_IndicatorLED26.K)
LED_IND27: IND16_31 (IND16_31.15), IndicatorLED27 (L1_IndicatorLED27.K)
LED_IND28: IND16_31 (IND16_31.16), IndicatorLED28 (L1_IndicatorLED28.K)
LED_IND29: IND16_31 (IND16_31.17), IndicatorLED29 (L1_IndicatorLED29.K)
LED_IND30: IND16_31 (IND16_31.18), IndicatorLED30 (L1_IndicatorLED30.K)
LED_IND31: IND16_31 (IND16_31.19), IndicatorLED31 (L1_IndicatorLED31.K)
LED_IND32: IND16_31 (IND16_31.20), IndicatorLED32 (L1_IndicatorLED32.K)
LED_SENS1: OPTO0_15 (OPTO0_15.5), LightSensor1 (OPTO1.K)
LED_SENS2: OPTO0_15 (OPTO0_15.6), LightSensor2 (U2_LightSensor2.K)
LED_SENS3: OPTO0_15 (OPTO0_15.7), LightSensor3 (U2_LightSensor3.K)
LED_SENS4: OPTO0_15 (OPTO0_15.8), LightSensor4 (U2_LightSensor4.K)
LED_SENS5: OPTO0_15 (OPTO0_15.9), LightSensor5 (U2_LightSensor5.K)
LED_SENS6: OPTO0_15 (OPTO0_15.10), LightSensor6 (U2_LightSensor6.K)
LED_SENS7: OPTO0_15 (OPTO0_15.11), LightSensor7 (U2_LightSensor7.K)
LED_SENS8: OPTO0_15 (OPTO0_15.12), LightSensor8 (U2_LightSensor8.K)
LED_SENS9: OPTO0_15 (OPTO0_15.13), LightSensor9 (U2_LightSensor9.K)
LED_SENS10: OPTO0_15 (OPTO0_15.14), LightSensor10 (U2_LightSensor10.K)
LED_SENS11: OPTO0_15 (OPTO0_15.15), LightSensor11 (U2_LightSensor11.K)
LED_SENS12: OPTO0_15 (OPTO0_15.16), LightSensor12 (U2_LightSensor12.K)
LED_SENS13: OPTO0_15 (OPTO0_15.17), LightSensor13 (U2_LightSensor13.K)
LED_SENS14: OPTO0_15 (OPTO0_15.18), LightSensor14 (U2_LightSensor14.K)
LED_SENS15: OPTO0_15 (OPTO0_15.19), LightSensor15 (U2_LightSensor15.K)
LED_SENS16: OPTO0_15 (OPTO0_15.20), LightSensor16 (U2_LightSensor16.K)
LED_SENS17: OPTO16_31 (OPTO16_31.5), LightSensor17 (U2_LightSensor17.K)
LED_SENS18: OPTO16_31 (OPTO16_31.6), LightSensor18 (U2_LightSensor18.K)
LED_SENS19: OPTO16_31 (OPTO16_31.7), LightSensor19 (U2_LightSensor19.K)
LED_SENS20: OPTO16_31 (OPTO16_31.8), LightSensor20 (U2_LightSensor20.K)
LED_SENS21: OPTO16_31 (OPTO16_31.9), LightSensor21 (U2_LightSensor21.K)
LED_SENS22: OPTO16_31 (OPTO16_31.10), LightSensor22 (U2_LightSensor22.K)
LED_SENS23: OPTO16_31 (OPTO16_31.11), LightSensor23 (U2_LightSensor23.K)
LED_SENS24: OPTO16_31 (OPTO16_31.12), LightSensor24 (U2_LightSensor24.K)
LED_SENS25: OPTO16_31 (OPTO16_31.13), LightSensor25 (U2_LightSensor25.K)
LED_SENS26: OPTO16_31 (OPTO16_31.14), LightSensor26 (U2_LightSensor26.K)
LED_SENS27: OPTO16_31 (OPTO16_31.15), LightSensor27 (U2_LightSensor27.K)
LED_SENS28: OPTO16_31 (OPTO16_31.16), LightSensor28 (U2_LightSensor28.K)
LED_SENS29: OPTO16_31 (OPTO16_31.17), LightSensor29 (U2_LightSensor29.K)
LED_SENS30: OPTO16_31 (OPTO16_31.18), LightSensor30 (U2_LightSensor30.K)
LED_SENS31: OPTO16_31 (OPTO16_31.19), LightSensor31 (U2_LightSensor31.K)
LED_SENS32: OPTO16_31 (OPTO16_31.20), LightSensor32 (OPTO32.K)
MISO: microcontroller (1.12), ADC0_7 (ADC0_7.15), ADC8_15 (ADC8_15.15), ADC16_23 (ADC16_23.15), ADC24_31 (ADC24_31.15)
MOSI: OPTO0_15 (OPTO0_15.2), microcontroller (1.13), ADC0_7 (ADC0_7.17), ADC8_15 (ADC8_15.17), ADC16_23 (ADC16_23.17), ADC24_31 (ADC24_31.17)
NetIND0_15_2: OPTO16_31 (OPTO16_31.22), IND0_15 (IND0_15.2)
NetIND0_15_22: IND0_15 (IND0_15.22), IND16_31 (IND16_31.2)
NetOPTO0_15_22: OPTO0_15 (OPTO0_15.22), OPTO16_31 (OPTO16_31.2)
~{OE_IND}: IND0_15 (IND0_15.21), IND16_31 (IND16_31.21), microcontroller (1.28)
~{OE_OPTO}: OPTO0_15 (OPTO0_15.21), OPTO16_31 (OPTO16_31.21), microcontroller (1.26)
~{SS_ADC1}: microcontroller (1.18), ADC0_7 (ADC0_7.18)
~{SS_ADC2}: microcontroller (1.19), ADC8_15 (ADC8_15.18)
~{SS_ADC3}: microcontroller (1.20), ADC16_23 (ADC16_23.18)
~{SS_ADC4}: microcontroller (1.21), ADC24_31 (ADC24_31.18)
SCK: OPTO0_15 (OPTO0_15.3), OPTO16_31 (OPTO16_31.3), IND0_15 (IND0_15.3), IND16_31 (IND16_31.3), microcontroller (1.11), ADC0_7 (ADC0_7.19), ADC8_15 (ADC8_15.19), ADC16_23 (ADC16_23.19), ADC24_31 (ADC24_31.19)